# Altium project ControlBoard.PrjPcb (part 1 of 3)
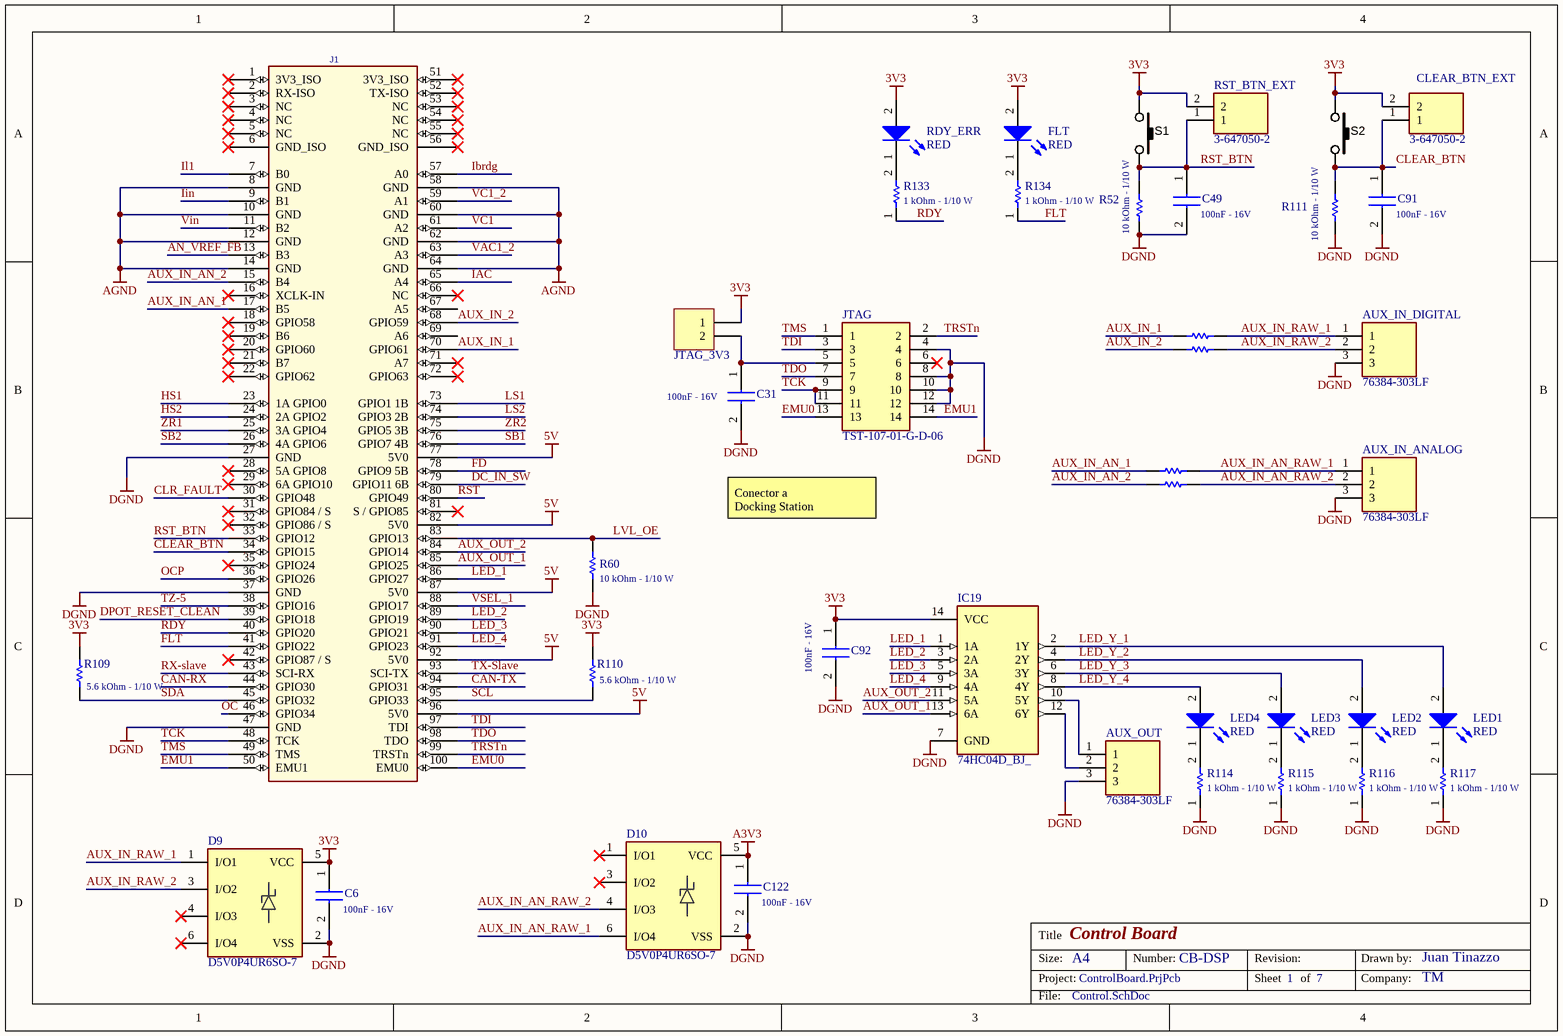
[diagram p0: Control.SchDoc]
REV: R8
7 sheets, 356 parts. Net scope: global (net labels, ports and power ports of the same name join across sheets).
Board file: PCB_ControlCard.PcbDoc
Sheets:
  Control.SchDoc
  Safety_Protections.SchDoc
  CAN.SchDoc
  Analogicas_Tension.SchDoc
  Analogicas_Corriente.SchDoc
  DriverSignals.SchDoc
  PSU.SchDoc

## Sheet Control.SchDoc: Control Board
size A4; CompanyName: TM; DrawnBy: Juan Tinazzo; Revision: R8; SheetNumber: 1; SheetTotal: 7; PageSetup: Record=PageOptions|CenterHorizontal=True|CenterVertical=True|PrintScale=1.20|XCorrection=1.00|YCorrection=1.00|PrintKind=1|BorderSize=5000000|LeftOffset=0|BottomOffset=0|Orientation=2|PaperLength=1000|PaperWidth=1000|Scale=100|PaperSource=7|PrintQuality=-3|MediaType=1|DitherType=10|PrintScaleMode=1|PaperKind=11 x 14 pulg.|PaperIndex=286; Number: CB-DSP

### Parts
AUX_IN_ANALOG  76384-303LF  [76384303LF]
AUX_IN_DIGITAL  76384-303LF  [76384303LF]
AUX_OUT  76384-303LF  [76384303LF]
C6  value 100nF - 16V  [CAPC1608X95N]  (hidden comment: 100n 16V 0603)
C31  value 100nF - 16V  [CAPC1608X95N]  (hidden comment: 100n 16V 0603)
C49  value 100nF - 16V  [CAPC1608X95N]  (hidden comment: 100n 16V 0603)
C91  value 100nF - 16V  [CAPC1608X95N]  (hidden comment: 100n 16V 0603)
C92  value 100nF - 16V  [CAPC1608X95N]  (hidden comment: 100n 16V 0603)
C122  value 100nF - 16V  [CAPC1608X95N]  (hidden comment: 100n 16V 0603)
CLEAR_BTN_EXT  3-647050-2  [36470502]
D9  D5V0P4UR6SO-7  [SOT95P285X140-6N]
D10  D5V0P4UR6SO-7  [SOT95P285X140-6N]
FLT  RED  [LEDC1608X80N]
IC19  74HC04D_BJ_  [SOIC127P600X175-14N]
J1  DIM100  [MOLEXDIMM-100-876301001_SD]  (value not drawn)
JTAG  TST-107-01-G-D-06  [TST10701GD06]
JTAG_3V3  Header 2  [HDR1X2]  (value not drawn)
LED1  RED  [LEDC1608X80N]
LED2  RED  [LEDC1608X80N]
LED3  RED  [LEDC1608X80N]
LED4  RED  [LEDC1608X80N]
R52  value 10 kOhm - 1/10 W  [RESC1608X50N]  (hidden comment: CRCW060310K0FKEA)
R60  value 10 kOhm - 1/10 W  [RESC1608X50N]  (hidden comment: CRCW060310K0FKEA)
R68  CRCW060375R0FKEAC  [RESC1608X55N]  (value not drawn)
R73  CRCW060375R0FKEAC  [RESC1608X55N]  (value not drawn)
R105  CRCW060375R0FKEAC  [RESC1608X55N]  (value not drawn)
R109  value 5.6 kOhm - 1/10 W  [RESC1608X50N]  (hidden comment: CRCW06035K60FKEA)
R110  value 5.6 kOhm - 1/10 W  [RESC1608X50N]  (hidden comment: CRCW06035K60FKEA)
R111  value 10 kOhm - 1/10 W  [RESC1608X50N]  (hidden comment: CRCW060310K0FKEA)
R114  value 1 kOhm - 1/10 W  [RESC1608X55N]  (hidden comment: CRCW06031K00FKEAC)
R115  value 1 kOhm - 1/10 W  [RESC1608X55N]  (hidden comment: CRCW06031K00FKEAC)
R116  value 1 kOhm - 1/10 W  [RESC1608X55N]  (hidden comment: CRCW06031K00FKEAC)
R117  value 1 kOhm - 1/10 W  [RESC1608X55N]  (hidden comment: CRCW06031K00FKEAC)
R121  CRCW060375R0FKEAC  [RESC1608X55N]  (value not drawn)
R133  value 1 kOhm - 1/10 W  [RESC1608X55N]  (hidden comment: CRCW06031K00FKEAC)
R134  value 1 kOhm - 1/10 W  [RESC1608X55N]  (hidden comment: CRCW06031K00FKEAC)
RDY_ERR  RED  [LEDC1608X80N]
RST_BTN_EXT  3-647050-2  [36470502]
S1  SW_THT_PB_5.0mm  [TACT_SWITCH_TL-1105-C]  (value not drawn)
S2  SW_THT_PB_5.0mm  [TACT_SWITCH_TL-1105-C]  (value not drawn)

### Nets
3V3: C6.1 C92.1 CLEAR_BTN_EXT.2 D9.5(VCC) FLT.2(A) IC19.14(VCC) JTAG_3V3.1 R109.2 R110.2 RDY_ERR.2(A) RST_BTN_EXT.2 S1.2 S2.2
5V: J1.77(5V0) J1.82(5V0) J1.87(5V0) J1.92(5V0) J1.96(5V0)
A3V3: C122.1 D10.5(VCC)
AGND: AUX_IN_ANALOG.3 AUX_IN_DIGITAL.3 AUX_OUT.3 C6.2 C31.2 C49.2 C91.2 C92.2 C122.2 D9.2(VSS) D10.2(VSS) IC19.7(GND) J1.8(GND) J1.10(GND) J1.12(GND) J1.14(GND) J1.27(GND) J1.37(GND) J1.47(GND) J1.58(GND) J1.60(GND) J1.62(GND) J1.64(GND) JTAG.4 JTAG.8 JTAG.10 JTAG.12 R52.1 R60.1 R111.1 R114.1 R115.1 R116.1 R117.1  [also labelled DGND]
AN_VREF_FB: J1.13(B3)
AUX_IN_1: J1.70(GPIO61) R68.1
AUX_IN_2: J1.68(GPIO59) R73.1
AUX_IN_AN_1: J1.17(B5) R105.1
AUX_IN_AN_2: J1.15(B4) R121.1
AUX_IN_AN_RAW_1: AUX_IN_ANALOG.1 D10.6(I/O4) R105.2
AUX_IN_AN_RAW_2: AUX_IN_ANALOG.2 D10.4(I/O3) R121.2
AUX_IN_RAW_1: AUX_IN_DIGITAL.1 D9.1(I/O1) R68.2
AUX_IN_RAW_2: AUX_IN_DIGITAL.2 D9.3(I/O2) R73.2
AUX_OUT_1: IC19.13(6A) J1.85(GPIO25)
AUX_OUT_2: IC19.11(5A) J1.84(GPIO14)
CAN-RX: J1.44(GPIO30)
CAN-TX: J1.94(GPIO31)
CLEAR_BTN: C91.1 CLEAR_BTN_EXT.1 J1.34(GPIO15) R111.2 S2.1
CLR_FAULT: J1.30(GPIO48)
DC_IN_SW: J1.79(GPIO11_6B)
DPOT_RESET_CLEAN: J1.39(GPIO18)
EMU0: J1.100(EMU0) JTAG.13
EMU1: J1.50(EMU1) JTAG.14
FD: J1.78(GPIO9_5B)
FLT: J1.41(GPIO22) R134.1
HS1: J1.23(1A_GPIO0)
HS2: J1.24(2A_GPIO2)
IAC: J1.65(A4)
Ibrdg: J1.57(A0)
Iin: J1.9(B1)
Il1: J1.7(B0)
LED_1: IC19.1(1A) J1.86(GPIO27)
LED_2: IC19.3(2A) J1.89(GPIO19)
LED_3: IC19.5(3A) J1.90(GPIO21)
LED_4: IC19.9(4A) J1.91(GPIO23)
LED_Y_1: IC19.2(1Y) LED1.2(A)
LED_Y_2: IC19.4(2Y) LED2.2(A)
LED_Y_3: IC19.6(3Y) LED3.2(A)
LED_Y_4: IC19.8(4Y) LED4.2(A)
LS1: J1.73(GPIO1_1B)
LS2: J1.74(GPIO3_2B)
LVL_OE: J1.83(GPIO13) R60.2
OC: J1.46(GPIO34)
OCP: J1.36(GPIO26)
RDY: J1.40(GPIO20) R133.1
RST: J1.80(GPIO49)
RST_BTN: C49.1 J1.33(GPIO12) R52.2 RST_BTN_EXT.1 S1.1
RX-slave: J1.43(SCI-RX)
SB1: J1.76(GPIO7_4B)
SB2: J1.26(4A_GPIO6)
SCL: J1.95(GPIO33) R110.1
SDA: J1.45(GPIO32) R109.1
TCK: J1.48(TCK) JTAG.9 JTAG.11
TDI: J1.97(TDI) JTAG.3
TDO: J1.98(TDO) JTAG.7
TMS: J1.49(TMS) JTAG.1
TRSTn: J1.99(TRSTn) JTAG.2
TX-Slave: J1.93(SCI-TX)
TZ-5: J1.38(GPIO16)
VAC1_2: J1.63(A3)
VC1: J1.61(A2)
VC1_2: J1.59(A1)
Vin: J1.11(B2)
VSEL_1: J1.88(GPIO17)
ZR1: J1.25(3A_GPIO4)
ZR2: J1.75(GPIO5_3B)
NetAUX_OUT_1: AUX_OUT.1 IC19.10(5Y)
NetAUX_OUT_2: AUX_OUT.2 IC19.12(6Y)
NetC31_1: C31.1 JTAG.5 JTAG_3V3.2
NetFLT_1: FLT.1(K) R134.2
NetLED1_1: LED1.1(K) R117.2
NetLED2_1: LED2.1(K) R116.2
NetLED3_1: LED3.1(K) R115.2
NetLED4_1: LED4.1(K) R114.2
NetR133_2: R133.2 RDY_ERR.1(K)

Not connected (* = marked no-connect by the designer): D9 4(I/O3)* 6(I/O4)*; D10 1(I/O1)* 3(I/O2)*; J1 1(3V3_ISO)* 2(RX-ISO)* 3(NC)* 4(NC)* 5(NC)* 6(GND_ISO)* 16(XCLK-IN)* 18(GPIO58)* 19(B6)* 20(GPIO60)* 21(B7)* 22(GPIO62)* 28(5A_GPIO8)* 29(6A_GPIO10)* 31(GPIO84_/_S)* 32(GPIO86_/_S)* 35(GPIO24)* 42(GPIO87_/_S)* 51(3V3_ISO)* 52(TX-ISO)* 53(NC)* 54(NC)* 55(NC)* 56(GND_ISO)* 66(NC)* 67(A5) 69(A6) 71(A7)* 72(GPIO63)* 81(S_/_GPIO85)*; JTAG 6*

### Notes on the sheet
- Conector a
  Docking Station
- Title
- Size:
- Project:
- A4
- Number:
- Revision:
- Sheet
- of
- Drawn by:
- Company:
- File:

### Library data of the parts
AUX_IN_ANALOG AUX_IN_DIGITAL AUX_OUT = 76384-303LF: Connector; Manufacturer_Name: Amphenol Communications Solutions; Value: Alojamientos de cables y cabecera 3P VERT; Datasheet Link: https://cdn.amphenol-cs.com/media/wysiwyg/files/drawing/76384.pdf; Height: 9.49mm; Manufacturer_Part_Number: 76384-303LF; Mouser Part Number: 649-76384-303LF
  AUX_IN_ANALOG: System: Connector
C6 C31 C49 C91 C92 C122 = EMK107B7104KA-T: Capacitor; Manufacturer_Name: TAIYO YUDEN; Datasheet Link: http://www.farnell.com/datasheets/746258.pdf; Height: 0.95mm; Manufacturer_Part_Number: EMK107B7104KA-T; Mouser Part Number: 963-EMK107B7104KA-T; Mouser Price/Stock: https://www.mouser.co.uk/ProductDetail/Taiyo-Yuden/EMK107B7104KA-T?qs=I6KAKw0tg2ybqzX8hKPgfw%3D%3D; Arrow Part Number: EMK107B7104KA-T; Arrow Price/Stock: https://www.arrow.com/en/products/emk107b7104ka-t/taiyo-yuden
CLEAR_BTN_EXT RST_BTN_EXT = 3-647050-2: Connector; Manufacturer_Name: TE Connectivity; Value: Button; Datasheet Link: https://www.te.com/commerce/DocumentDelivery/DDEController?Action=srchrtrv&DocNm=647050&DocType=Customer+Drawing&DocLang=English&PartCntxt=3-647050-2&DocFormat=pdf; Height: 10.79mm; Manufacturer_Part_Number: 3-647050-2; Mouser Part Number: 571-3-647050-2; Mouser Price/Stock: https://www.mouser.co.uk/ProductDetail/TE-Connectivity-AMP/3-647050-2?qs=W5ux9j661SpBFGFPk8vxRQ%3D%3D; System: Connector
D9 D10 = D5V0P4UR6SO-7: TVS Diode (Uni-directional); Manufacturer_Name: Diodes Inc.; Value: 4CH - Unidireccional - 3.3V - 800mW; Datasheet Link: https://www.arrow.com/en/products/d5v0p4ur6so-7/diodes-incorporated; Height: 1.4mm; Manufacturer_Part_Number: D5V0P4UR6SO-7; Mouser Part Number: 621-D5V0P4UR6SO-7; Mouser Price/Stock: https://www.mouser.co.uk/ProductDetail/Diodes-Incorporated/D5V0P4UR6SO-7?qs=rN85NNvew%2FSjbewGRfhy7A%3D%3D; Arrow Part Number: D5V0P4UR6SO-7; Arrow Price/Stock: https://www.arrow.com/en/products/d5v0p4ur6so-7/diodes-incorporated?region=nac
FLT LED1-LED4 RDY_ERR = 150060RS75000: LED; Manufacturer_Name: Wurth Elektronik; Value: Led Rojo 0603; Datasheet Link: http://katalog.we-online.de/led/datasheet/150060RS75000.pdf; Height: 0.8mm; Manufacturer_Part_Number: 150060RS75000; Mouser Part Number: 710-150060RS75000; Mouser Price/Stock: https://www.mouser.co.uk/ProductDetail/Wurth-Elektronik/150060RS75000?qs=LlUlMxKIyB3QnmZ3fw%2FVCA%3D%3D
IC19 = 74HC04D_BJ_: Integrated Circuit; Manufacturer_Name: Toshiba; Manufacturer_Part_Number: 74HC04D(BJ); Value: Inversores CMOS logic IC series; Datasheet Link: http://toshiba.semicon-storage.com/info/docget.jsp?did=37182&prodName=74HC04D; Height: 1.75mm; Mouser Part Number: 757-74HC04DBJ; Mouser Price/Stock: https://www.mouser.co.uk/ProductDetail/Toshiba/74HC04DBJ?qs=kdd6aVn74hyhHdfHNvZcvA%3D%3D; Arrow Part Number: 74HC04D(BJ); Arrow Price/Stock: https://www.arrow.com/en/products/74hc04d-bj/toshiba?region=europe
J1 = HDR_DIM_100: CONN, 100 pin DIMM socket - Molex 0876301001; Value: Conectores DIMM; Manufacturer_Part_Number: 0876301001
JTAG = TST-107-01-G-D-06: Connector; Manufacturer_Name: SAMTEC; Value: Alojamientos de cables y cabecera Shrouded PCB Headers, 0.100" pitch; Datasheet Link: https://www.arrow.com/en/products/tst-107-01-g-d-06/samtec; Height: 9.27mm; Manufacturer_Part_Number: TST-107-01-G-D-06; Mouser Part Number: 200-TST10701GD06; Mouser Price/Stock: https://www.mouser.co.uk/ProductDetail/Samtec/TST-107-01-G-D-06?qs=rU5fayqh%252BE2aRBN6ChnNCw%3D%3D; Arrow Part Number: TST-107-01-G-D-06; Arrow Price/Stock: https://www.arrow.com/en/products/tst-107-01-g-d-06/samtec?region=nac
JTAG_3V3 = Header 2: Header, 2-Pin; Manufacturer_Part_Number: Header 2.54 mm 2P; Value: Jumper
R52 R60 R111 = CRCW060310K0FKEA: Resistor; Manufacturer_Name: Vishay; Datasheet Link: http://www.vishay.com/docs/20035/dcrcwe3.pdf; Height: 0.5mm; Manufacturer_Part_Number: CRCW060310K0FKEA; Mouser Part Number: 71-CRCW0603-10K-E3; Mouser Price/Stock: https://www.mouser.co.uk/ProductDetail/Vishay-Dale/CRCW060310K0FKEA?qs=pAO1Z172M84BVnhDjtnsoQ%3D%3D; Arrow Part Number: CRCW060310K0FKEA; Arrow Price/Stock: https://www.arrow.com/en/products/crcw060310k0fkea/vishay?region=nac
R68 R73 R105 R121 = CRCW060375R0FKEAC: Resistor; Manufacturer_Name: Vishay; Value: 75 Ohm - 1/10 W; Datasheet Link: https://www.arrow.com/en/products/crcw060375r0fkeac/vishay; Height: 0.55mm; Manufacturer_Part_Number: CRCW060375R0FKEAC; Mouser Part Number: 71-CRCW060375R0FKEAC; Mouser Price/Stock: https://www.mouser.co.uk/ProductDetail/Vishay-Dale/CRCW060375R0FKEAC?qs=E3Y5ESvWgWPOxF9wqCfv4A%3D%3D; Arrow Part Number: CRCW060375R0FKEAC; Arrow Price/Stock: https://www.arrow.com/en/products/crcw060375r0fkeac/vishay?region=nac
R109 R110 = CRCW06035K60FKEA: Resistor; Manufacturer_Name: Vishay; Datasheet Link: http://www.vishay.com/docs/20035/dcrcwe3.pdf; Height: 0.5mm; Manufacturer_Part_Number: CRCW06035K60FKEA; Mouser Part Number: 71-CRCW0603-5.6K-E3; Mouser Price/Stock: https://www.mouser.co.uk/ProductDetail/Vishay-Dale/CRCW06035K60FKEA?qs=%2FAtLfjUBFoX1vHGCl0oHag%3D%3D; Arrow Part Number: CRCW06035K60FKEA; Arrow Price/Stock: https://www.arrow.com/en/products/crcw06035k60fkea/vishay
R114-R117 R133 R134 = CRCW06031K00FKEAC: Resistor; Manufacturer_Name: Vishay; Datasheet Link: https://www.vishay.com/docs/28773/crcwce3.pdf; Height: 0.55mm; Manufacturer_Part_Number: CRCW06031K00FKEAC; Mouser Part Number: 71-CRCW06031K00FKEAC; Mouser Price/Stock: https://www.mouser.co.uk/ProductDetail/Vishay-Dale/CRCW06031K00FKEAC?qs=E3Y5ESvWgWOQ7ePIWbGVFg%3D%3D; Arrow Part Number: CRCW06031K00FKEAC; Arrow Price/Stock: https://www.arrow.com/en/products/crcw06031k00fkeac/vishay?region=nac
S1 S2 = SW_THT_PB_5.0mm: Switch, tact, 5.0mm stem; Manufacturer 1: Wealth Metal; Manufacturer Part Number 1: TC-37XB; Manufacturer_Part_Number: STD Button; Function: On/Off; SCDType: spec; Value: 6.5x6.5mm; 5.0mm stem; Package / Case: 6.5x6.5mm; 5.0mm stem; Material: Brass/Nylon/Ag plating

## Sheet Safety_Protections.SchDoc: Safety Protections
size A3; DrawnBy: Juan Tinazzo; Revision: R8; SheetNumber: 2; SheetTotal: 7; Number: CB-SP; Company: TM
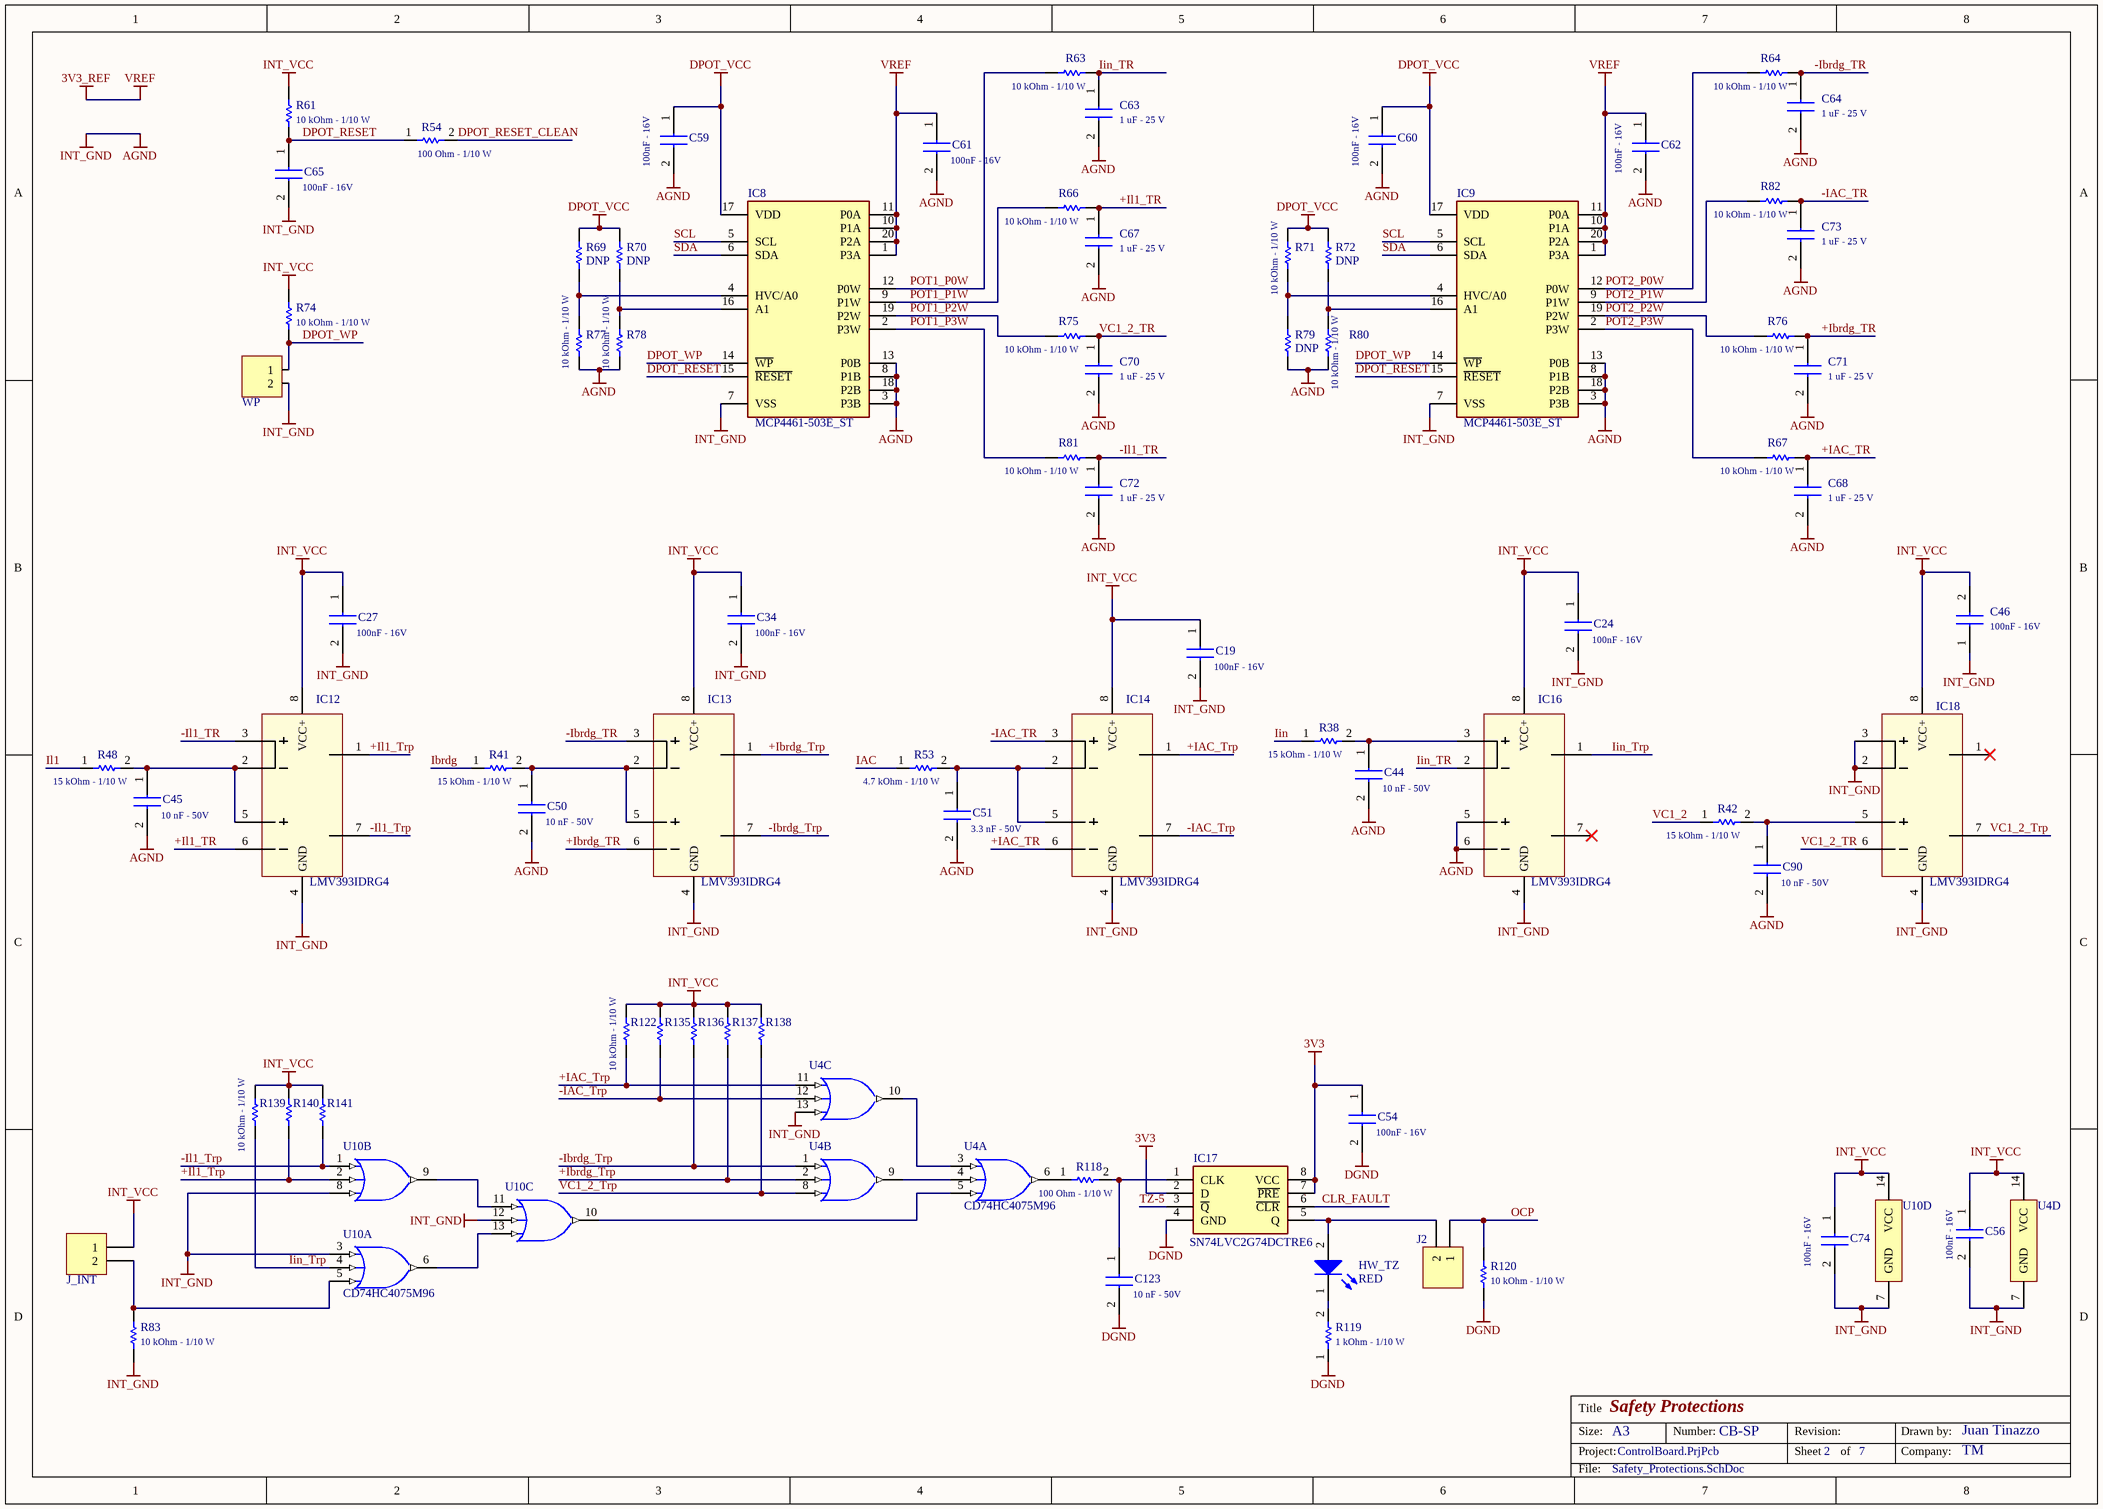
[diagram p1: Safety_Protections.SchDoc]

### Parts
C19  value 100nF - 16V  [CAPC1608X95N]  (hidden comment: 100n 16V 0603)
C24  value 100nF - 16V  [CAPC1608X95N]  (hidden comment: 100n 16V 0603)
C27  value 100nF - 16V  [CAPC1608X95N]  (hidden comment: 100n 16V 0603)
C34  value 100nF - 16V  [CAPC1608X95N]  (hidden comment: 100n 16V 0603)
C44  value 10 nF - 50V  [C0603]  (hidden comment: 220p 50V 5% 0603)
C45  value 10 nF - 50V  [C0603]  (hidden comment: 220p 50V 5% 0603)
C46  value 100nF - 16V  [CAPC1608X95N]  (hidden comment: 100n 16V 0603)
C50  value 10 nF - 50V  [C0603]  (hidden comment: 220p 50V 5% 0603)
C51  value 3.3 nF - 50V  [C0603]  (hidden comment: 220p 50V 5% 0603)
C54  value 100nF - 16V  [CAPC1608X95N]  (hidden comment: 100n 16V 0603)
C56  value 100nF - 16V  [CAPC1608X95N]  (hidden comment: 100n 16V 0603)
C59  value 100nF - 16V  [CAPC1608X95N]  (hidden comment: 100n 16V 0603)
C60  value 100nF - 16V  [CAPC1608X95N]  (hidden comment: 100n 16V 0603)
C61  value 100nF - 16V  [CAPC1608X95N]  (hidden comment: 100n 16V 0603)
C62  value 100nF - 16V  [CAPC1608X95N]  (hidden comment: 100n 16V 0603)
C63  value 1 uF - 25 V  [CAPC2012X135N]  (hidden comment: 1u)
C64  value 1 uF - 25 V  [CAPC2012X135N]  (hidden comment: 1u)
C65  value 100nF - 16V  [CAPC1608X95N]  (hidden comment: 100n 16V 0603)
C67  value 1 uF - 25 V  [CAPC2012X135N]  (hidden comment: 1u)
C68  value 1 uF - 25 V  [CAPC2012X135N]  (hidden comment: 1u)
C70  value 1 uF - 25 V  [CAPC2012X135N]  (hidden comment: 1u)
C71  value 1 uF - 25 V  [CAPC2012X135N]  (hidden comment: 1u)
C72  value 1 uF - 25 V  [CAPC2012X135N]  (hidden comment: 1u)
C73  value 1 uF - 25 V  [CAPC2012X135N]  (hidden comment: 1u)
C74  value 100nF - 16V  [CAPC1608X95N]  (hidden comment: 100n 16V 0603)
C90  value 10 nF - 50V  [C0603]  (hidden comment: 220p 50V 5% 0603)
C123  value 10 nF - 50V  [C0603]  (hidden comment: 220p 50V 5% 0603)
HW_TZ  RED  [LEDC1608X80N]
IC8  MCP4461-503E_ST  [SOP65P640X120-20N]
IC9  MCP4461-503E_ST  [SOP65P640X120-20N]
IC12  LMV393IDRG4  [SOIC127P600X175-8N]
IC13  LMV393IDRG4  [SOIC127P600X175-8N]
IC14  LMV393IDRG4  [SOIC127P600X175-8N]
IC16  LMV393IDRG4  [SOIC127P600X175-8N]
IC17  SN74LVC2G74DCTRE6  [SOP65P400X130-8N]
IC18  LMV393IDRG4  [SOIC127P600X175-8N]
J2  Header 2  [HDR1X2]  (value not drawn)
J_INT  Header 2  [HDR1X2]  (value not drawn)
R38  value 15 kOhm - 1/10 W  [RESC1608X55N]  (hidden comment: CRCW0603100RFKEBC)
R41  value 15 kOhm - 1/10 W  [RESC1608X55N]  (hidden comment: CRCW0603100RFKEBC)
R42  value 15 kOhm - 1/10 W  [RESC1608X55N]  (hidden comment: CRCW0603100RFKEBC)
R48  value 15 kOhm - 1/10 W  [RESC1608X55N]  (hidden comment: CRCW0603100RFKEBC)
R53  value 4.7 kOhm - 1/10 W  [RESC1608X55N]  (hidden comment: CRCW0603100RFKEBC)
R54  value 100 Ohm - 1/10 W  [RESC1608X55N]  (hidden comment: CRCW0603100RFKEBC)
R61  value 10 kOhm - 1/10 W  [RESC1608X50N]  (hidden comment: CRCW060310K0FKEA)
R63  value 10 kOhm - 1/10 W  [RESC1608X50N]  (hidden comment: CRCW060310K0FKEA)
R64  value 10 kOhm - 1/10 W  [RESC1608X50N]  (hidden comment: CRCW060310K0FKEA)
R66  value 10 kOhm - 1/10 W  [RESC1608X50N]  (hidden comment: CRCW060310K0FKEA)
R67  value 10 kOhm - 1/10 W  [RESC1608X50N]  (hidden comment: CRCW060310K0FKEA)
R69  DNP  [RESC1608X50N]
R70  DNP  [RESC1608X50N]
R71  value 10 kOhm - 1/10 W  [RESC1608X50N]  (hidden comment: CRCW060310K0FKEA)
R72  DNP  [RESC1608X50N]
R74  value 10 kOhm - 1/10 W  [RESC1608X50N]  (hidden comment: CRCW060310K0FKEA)
R75  value 10 kOhm - 1/10 W  [RESC1608X50N]  (hidden comment: CRCW060310K0FKEA)
R76  value 10 kOhm - 1/10 W  [RESC1608X50N]  (hidden comment: CRCW060310K0FKEA)
R77  value 10 kOhm - 1/10 W  [RESC1608X50N]  (hidden comment: CRCW060310K0FKEA)
R78  value 10 kOhm - 1/10 W  [RESC1608X50N]  (hidden comment: CRCW060310K0FKEA)
R79  DNP  [RESC1608X50N]
R80  value 10 kOhm - 1/10 W  [RESC1608X50N]  (hidden comment: CRCW060310K0FKEA)
R81  value 10 kOhm - 1/10 W  [RESC1608X50N]  (hidden comment: CRCW060310K0FKEA)
R82  value 10 kOhm - 1/10 W  [RESC1608X50N]  (hidden comment: CRCW060310K0FKEA)
R83  value 10 kOhm - 1/10 W  [RESC1608X50N]  (hidden comment: CRCW060310K0FKEA)
R118  value 100 Ohm - 1/10 W  [RESC1608X55N]  (hidden comment: CRCW0603100RFKEBC)
R119  value 1 kOhm - 1/10 W  [RESC1608X55N]  (hidden comment: CRCW06031K00FKEAC)
R120  value 10 kOhm - 1/10 W  [RESC1608X50N]  (hidden comment: CRCW060310K0FKEA)
R122  value 10 kOhm - 1/10 W  [RESC1608X50N]  (hidden comment: CRCW060310K0FKEA)
R135  CRCW060310K0FKEA  [RESC1608X50N]  (value not drawn)
R136  CRCW060310K0FKEA  [RESC1608X50N]  (value not drawn)
R137  CRCW060310K0FKEA  [RESC1608X50N]  (value not drawn)
R138  CRCW060310K0FKEA  [RESC1608X50N]  (value not drawn)
R139  value 10 kOhm - 1/10 W  [RESC1608X50N]  (hidden comment: CRCW060310K0FKEA)
R140  CRCW060310K0FKEA  [RESC1608X50N]  (value not drawn)
R141  CRCW060310K0FKEA  [RESC1608X50N]  (value not drawn)
U4  CD74HC4075M96  [SOIC127P600X175-14N]  (parts A,B,C,D of 4)
U10  CD74HC4075M96  [SOIC127P600X175-14N]  (parts A,B,C,D of 4)
WP  Header 2  [HDR1X2]  (value not drawn)

### Nets
3V3: C54.1 IC17.2(D) IC17.7(~{PRE}) IC17.8(VCC)
3V3_REF: C61.1 C62.1 IC8.1(P3A) IC8.10(P1A) IC8.11(P0A) IC8.20(P2A) IC9.1(P3A) IC9.10(P1A) IC9.11(P0A) IC9.20(P2A)  [also labelled VREF]
AGND: C19.2 C24.2 C27.2 C34.2 C44.2 C45.2 C46.1 C50.2 C51.2 C54.2 C56.2 C59.2 C60.2 C61.2 C62.2 C63.2 C64.2 C65.2 C67.2 C68.2 C70.2 C71.2 C72.2 C73.2 C74.2 C90.2 C123.2 IC8.3(P3B) IC8.7(VSS) IC8.8(P1B) IC8.13(P0B) IC8.18(P2B) IC9.3(P3B) IC9.7(VSS) IC9.8(P1B) IC9.13(P0B) IC9.18(P2B) IC12.4(GND) IC13.4(GND) IC14.4(GND) IC16.4(GND) IC16.5(2IN+) IC16.6(2IN-) IC17.4(GND) IC18.2(1IN-) IC18.3(1IN+) IC18.4(GND) R77.2 R78.2 R79.2 R80.2 R83.2 R119.1 R120.2 U4.7(GND) U4.13(3C) U10.3(1A) U10.7(GND) U10.8(2C) U10.12(3B) WP.2  [also labelled DGND, INT_GND]
DPOT_VCC: C59.1 C60.1 IC8.17(VDD) IC9.17(VDD) R69.1 R70.1 R71.1 R72.1
INT_VCC: C19.1 C24.1 C27.1 C34.1 C46.2 C56.1 C74.1 IC12.8(VCC+) IC13.8(VCC+) IC14.8(VCC+) IC16.8(VCC+) IC18.8(VCC+) J_INT.1 R61.1 R74.1 R122.1 R135.1 R136.1 R137.1 R138.1 R139.1 R140.1 R141.1 U4.14(VCC) U10.14(VCC)
+IAC_TR: C68.1 IC14.6(2IN-) R67.1
+IAC_Trp: IC14.1(1OUT) R122.2 U4.11(3A)
+Ibrdg_TR: C71.1 IC13.6(2IN-) R76.1
+Ibrdg_Trp: IC13.1(1OUT) R137.2 U4.2(2B)
+Il1_TR: C67.1 IC12.6(2IN-) R66.1
+Il1_Trp: IC12.1(1OUT) R140.2 U10.2(2B)
-IAC_TR: C73.1 IC14.3(1IN+) R82.1
-IAC_Trp: IC14.7(2OUT) R135.2 U4.12(3B)
-Ibrdg_TR: C64.1 IC13.3(1IN+) R64.1
-Ibrdg_Trp: IC13.7(2OUT) R136.2 U4.1(2A)
-Il1_TR: C72.1 IC12.3(1IN+) R81.1
-Il1_Trp: IC12.7(2OUT) R141.2 U10.1(2A)
CLR_FAULT: IC17.6(~{CLR})
DPOT_RESET: C65.1 IC8.15(~{RESET}) IC9.15(~{RESET}) R54.1 R61.2
DPOT_RESET_CLEAN: R54.2
DPOT_WP: IC8.14(~{WP}) IC9.14(~{WP}) R74.2 WP.1
IAC: R53.1
Ibrdg: R41.1
Iin: R38.1
Iin_TR: C63.1 IC16.2(1IN-) R63.1
Iin_Trp: IC16.1(1OUT) R139.2 U10.4(1B)
Il1: R48.1
OCP: J2.1 R120.1
POT1_P0W: IC8.12(P0W) R63.2
POT1_P1W: IC8.9(P1W) R66.2
POT1_P2W: IC8.19(P2W) R75.2
POT1_P3W: IC8.2(P3W) R81.2
POT2_P0W: IC9.12(P0W) R64.2
POT2_P1W: IC9.9(P1W) R82.2
POT2_P2W: IC9.19(P2W) R76.2
POT2_P3W: IC9.2(P3W) R67.2
SCL: IC8.5(SCL) IC9.5(SCL)
SDA: IC8.6(SDA) IC9.6(SDA)
TZ-5: IC17.3(~{Q})
VC1_2: R42.1
VC1_2_TR: C70.1 IC18.6(2IN-) R75.1
VC1_2_Trp: IC18.7(2OUT) R138.2 U4.8(2C)
NetC44_1: C44.1 IC16.3(1IN+) R38.2
NetC45_1: C45.1 IC12.2(1IN-) IC12.5(2IN+) R48.2
NetC50_1: C50.1 IC13.2(1IN-) IC13.5(2IN+) R41.2
NetC51_1: C51.1 IC14.2(1IN-) IC14.5(2IN+) R53.2
NetC90_1: C90.1 IC18.5(2IN+) R42.2
NetC123_1: C123.1 IC17.1(CLK) R118.2
NetHW_TZ_1: HW_TZ.1(K) R119.2
NetHW_TZ_2: HW_TZ.2(A) IC17.5(Q) J2.2
NetIC8_4: IC8.4(HVC/A0) R69.2 R77.1
NetIC8_16: IC8.16(A1) R70.2 R78.1
NetIC9_4: IC9.4(HVC/A0) R71.2 R79.1
NetIC9_16: IC9.16(A1) R72.2 R80.1
NetJ_INT_2: J_INT.2 R83.1 U10.5(1C)
NetR118_1: R118.1 U4.6(1Y)
NetU4_3: U4.3(1A) U4.10(3Y)
NetU4_4: U4.4(1B) U4.9(2Y)
NetU4_5: U4.5(1C) U10.10(3Y)
NetU10_6: U10.6(1Y) U10.13(3C)
NetU10_9: U10.9(2Y) U10.11(3A)

Not connected (* = marked no-connect by the designer): IC16 7(2OUT)*; IC18 1(1OUT)*

### Notes on the sheet
- Title
- Size:
- Project:
- A3
- Number:
- Revision:
- Sheet
- of
- Drawn by:
- Company:
- File:

### Library data of the parts
C19 C24 C27 C34 C46 C54 C56 C59-C62 C65 C74 = EMK107B7104KA-T: as C6 on sheet Control; Datasheet Link: http://www.farnell.com/datasheets/746258.pdf; Height: 0.95mm; Manufacturer_Part_Number: EMK107B7104KA-T; Mouser Part Number: 963-EMK107B7104KA-T; Arrow Part Number: EMK107B7104KA-T; Arrow Price/Stock: https://www.arrow.com/en/products/emk107b7104ka-t/taiyo-yuden
  C19 C24 C27 C34 C54 C56 C59-C62 C65 C74: Mouser Price/Stock: https://www.mouser.co.uk/ProductDetail/Taiyo-Yuden/EMK107B7104KA-T?qs=I6KAKw0tg2ybqzX8hKPgfw%3D%3D
  C46: Mouser Price/Stock: https://www.mouser.co.uk/ProductDetail/TAIYO-YUDEN/EMK107B7104KA-T?qs=I6KAKw0tg2ybqzX8hKPgfw%3D%3D
C44 C45 C50 C90 C123 = C0603C221J5HACAUTO: Capacitor; Manufacturer_Name: KEMET; Manufacturer_Part_Number: CGA3E2X7R1H103K080AA; Datasheet Link: https://content.kemet.com/datasheets/KEM_C1007_X8R_ULTRA_150C_SMD.pdf; Height: 0.87mm; Mouser Part Number: 80-C0603C221J5HAUTO; Mouser Price/Stock: https://www.mouser.co.uk/ProductDetail/KEMET/C0603C221J5HACAUTO?qs=j%252B1pi9TdxUZayjzZ3rh80g%3D%3D
C51 = C0603C221J5HACAUTO: Capacitor; Manufacturer_Name: KEMET; Datasheet Link: https://content.kemet.com/datasheets/KEM_C1007_X8R_ULTRA_150C_SMD.pdf; Height: 0.87mm; Manufacturer_Part_Number: C0603C221J5HACAUTO; Mouser Part Number: 80-C0603C221J5HAUTO; Mouser Price/Stock: https://www.mouser.co.uk/ProductDetail/KEMET/C0603C221J5HACAUTO?qs=j%252B1pi9TdxUZayjzZ3rh80g%3D%3D
C63 C64 C67 C68 C70-C73 = CL21B105KAFNNNG: Capacitor; Manufacturer_Name: SAMSUNG; Datasheet Link: https://datasheet.datasheetarchive.com/originals/distributors/Datasheets-DGA8/2478773.pdf; Height: 1.35mm; Manufacturer_Part_Number: CL21B105KAFNNNG; Mouser Part Number: 187-CL21B105KAFNNNG; Mouser Price/Stock: https://www.mouser.co.uk/ProductDetail/Samsung-Electro-Mechanics/CL21B105KAFNNNG?qs=yOVawPpwOwmXkU%252BG0TK%2F5g%3D%3D; Arrow Part Number: CL21B105KAFNNNG; Arrow Price/Stock: https://www.arrow.com/en/products/cl21b105kafnnng/samsung-electro-mechanics?region=europe
HW_TZ = 150060RS75000: as FLT on sheet Control; Datasheet Link: http://katalog.we-online.de/led/datasheet/150060RS75000.pdf; Height: 0.8mm; Manufacturer_Part_Number: 150060RS75000; Mouser Part Number: 710-150060RS75000; Mouser Price/Stock: https://www.mouser.co.uk/ProductDetail/Wurth-Elektronik/150060RS75000?qs=LlUlMxKIyB3QnmZ3fw%2FVCA%3D%3D
IC8 IC9 = MCP4461-503E_ST: Integrated Circuit; Manufacturer_Name: Microchip; Manufacturer_Part_Number: MCP4461-503E/ST; Value: Circuitos integrados de potenciómetros digitales 50k I2C quad ch 8bit nonvolatile memory; Datasheet Link: https://datasheet.datasheetarchive.com/originals/dk/DKDS-14/279656.pdf; Height: 1.2mm; Mouser Part Number: 579-MCP4461503EST; Mouser Price/Stock: https://www.mouser.co.uk/ProductDetail/Microchip-Technology/MCP4461-503E-ST?qs=hort8UWU32ogb6GG%252BEGOkQ%3D%3D; Arrow Part Number: MCP4461-503E/ST; Arrow Price/Stock: https://www.arrow.com/en/products/mcp4461-503est/microchip-technology
IC12-IC14 IC16 IC18 = LMV393IDRG4: Integrated Circuit; Manufacturer_Name: Texas Instruments; Value: Comparadores analógicos Dual Gen Purp; Datasheet Link: https://www.ti.com/lit/gpn/lmv393; Height: 1.75mm; Manufacturer_Part_Number: LMV393IDRG4; Mouser Part Number: 595-LMV393IDRG4; Mouser Price/Stock: https://www.mouser.co.uk/ProductDetail/Texas-Instruments/LMV393IDRG4?qs=tP77tliwutC5frth4oKpcg%3D%3D; Arrow Part Number: LMV393IDRG4; Arrow Price/Stock: https://www.arrow.com/en/products/lmv393idrg4/texas-instruments?region=nac
IC17 = SN74LVC2G74DCTRE6: Integrated Circuit; Manufacturer_Name: Texas Instruments; Value: Single Positive-Edge-Triggered D-Type Flip-Flop; Datasheet Link: https://www.ti.com/lit/ds/symlink/sn74lvc2g74.pdf?ts=1629109043918&ref_url=https%253A%252F%252Fwww.ti.com%252Fstore%252Fti%252Fen%252Fp%252Fproduct%252F%253Fp%253DSN74LVC2G74DCTRE6; Height: 1.3mm; Manufacturer_Part_Number: SN74LVC2G74DCTRE6; Mouser Part Number: 595-74LVC2G74DCTRE6; Mouser Price/Stock: https://www.mouser.co.uk/ProductDetail/Texas-Instruments/SN74LVC2G74DCTRE6?qs=byeeYqUIh0MaOLKxYGSbxw%3D%3D; Arrow Part Number: SN74LVC2G74DCTRE6; Arrow Price/Stock: https://www.arrow.com/en/products/sn74lvc2g74dctre6/texas-instruments?region=nac
J2 J_INT WP = Header 2: Header, 2-Pin; Manufacturer_Part_Number: Header 2.54 mm 2P; Value: 2P
R38 R41 R42 R48 = CRCW0603100RFKEBC: Resistor; Manufacturer_Name: Vishay; Manufacturer_Part_Number: CRCW060315K0FKEAC; Datasheet Link: https://www.vishay.com/docs/28773/crcwce3.pdf; Height: 0.55mm; Mouser Part Number: 71-CRCW0603100RFKEBC; Mouser Price/Stock: https://www.mouser.co.uk/ProductDetail/Vishay-Dale/CRCW0603100RFKEBC?qs=wd5RIQLrsJhdvQFtBw4oWg%3D%3D; Arrow Part Number: CRCW0603100RFKEBC; Arrow Price/Stock: https://www.arrow.com/en/products/crcw0603100rfkebc/vishay?region=nac
R53 = CRCW0603100RFKEBC: Resistor; Manufacturer_Name: Vishay; Manufacturer_Part_Number: CRCW06034K70FKEAHP; Datasheet Link: https://www.vishay.com/docs/28773/crcwce3.pdf; Height: 0.55mm; Mouser Part Number: 71-CRCW0603100RFKEBC; Mouser Price/Stock: https://www.mouser.co.uk/ProductDetail/Vishay-Dale/CRCW0603100RFKEBC?qs=wd5RIQLrsJhdvQFtBw4oWg%3D%3D; Arrow Part Number: CRCW0603100RFKEBC; Arrow Price/Stock: https://www.arrow.com/en/products/crcw0603100rfkebc/vishay?region=nac
R54 R118 = CRCW0603100RFKEBC: Resistor; Manufacturer_Name: Vishay; Datasheet Link: https://www.vishay.com/docs/28773/crcwce3.pdf; Height: 0.55mm; Manufacturer_Part_Number: CRCW0603100RFKEBC; Mouser Part Number: 71-CRCW0603100RFKEBC; Mouser Price/Stock: https://www.mouser.co.uk/ProductDetail/Vishay-Dale/CRCW0603100RFKEBC?qs=wd5RIQLrsJhdvQFtBw4oWg%3D%3D; Arrow Part Number: CRCW0603100RFKEBC; Arrow Price/Stock: https://www.arrow.com/en/products/crcw0603100rfkebc/vishay?region=nac
R61 R63 R64 R66 R67 R71 R74-R78 R80-R83 R120 R122 R139 = CRCW060310K0FKEA: Resistor; Manufacturer_Name: Vishay; Datasheet Link: http://www.vishay.com/docs/20035/dcrcwe3.pdf; Height: 0.5mm; Manufacturer_Part_Number: CRCW060310K0FKEA; Mouser Part Number: 71-CRCW0603-10K-E3; Mouser Price/Stock: https://www.mouser.co.uk/ProductDetail/Vishay-Dale/CRCW060310K0FKEA?qs=pAO1Z172M84BVnhDjtnsoQ%3D%3D; Arrow Part Number: CRCW060310K0FKEA; Arrow Price/Stock: https://www.arrow.com/en/products/crcw060310k0fkea/vishay?region=nac
R69 R70 R72 R79 R135-R138 R140 R141 = CRCW060310K0FKEA: Resistor; Manufacturer_Name: Vishay; Value: 10 kOhm - 1/10 W; Datasheet Link: http://www.vishay.com/docs/20035/dcrcwe3.pdf; Height: 0.5mm; Manufacturer_Part_Number: CRCW060310K0FKEA; Mouser Part Number: 71-CRCW0603-10K-E3; Mouser Price/Stock: https://www.mouser.co.uk/ProductDetail/Vishay-Dale/CRCW060310K0FKEA?qs=pAO1Z172M84BVnhDjtnsoQ%3D%3D; Arrow Part Number: CRCW060310K0FKEA; Arrow Price/Stock: https://www.arrow.com/en/products/crcw060310k0fkea/vishay?region=nac
R119 = CRCW06031K00FKEAC: Resistor; Manufacturer_Name: Vishay; Datasheet Link: https://www.vishay.com/docs/28773/crcwce3.pdf; Height: 0.55mm; Manufacturer_Part_Number: CRCW06031K00FKEAC; Mouser Part Number: 71-CRCW06031K00FKEAC; Mouser Price/Stock: https://www.mouser.co.uk/ProductDetail/Vishay-Dale/CRCW06031K00FKEAC?qs=E3Y5ESvWgWOQ7ePIWbGVFg%3D%3D; Arrow Part Number: CRCW06031K00FKEAC; Arrow Price/Stock: https://www.arrow.com/en/products/crcw06031k00fkeac/vishay?region=nac
U4 U10 = CD74HC4075M96: High Speed CMOS Logic Triple 3-Input OR Gates, D0014A, LARGE T&R; Manufacturer: Texas Instruments; VCC(Min)(V): 2; VCC(Max)(V): 6; ICC @ Nom Voltage(Max)(mA): 0.02; Bits(#): 3; F @ Nom Voltage(Max)(Mhz): 70; Rating: Catalog; Voltage(Nom)(V): 5; Output Drive (IOL/IOH)(Max)(mA): 5.2/-5.2; tpd @ Nom Voltage(Max)(ns): 25; Value: Puertas lógicas Triple 3-Input OR; DatasheetVersion: SCHS210G; PackageReference: D0014A; Generic Part Number: CD74HC4075; Output Type: CMOS; Input Type: CMOS; Operating Temperature Range(C): -55 to 125; Code_JEDEC: MS-012; PartNumber: CD74HC4075M96; ComponentLink1Description: Manufacturer URL; ComponentLink1URL: http://www.ti.com/; ComponentLink2Description: Datasheet; ComponentLink2URL: http://www.ti.com/lit/ds/symlink/cd74hc4075.pdf; ComponentLink3Description: Package Specification; ComponentLink3URL: http://www.ti.com/lit/ml/mpds177g/mpds177g.pdf; Datasheet Link: http://www.ti.com/lit/ds/symlink/cd74hc4075.pdf; Mouser Part Number: 595-CD74HC4075M96; Manufacturer_Part_Number: CD74HC4075M96

## Sheet CAN.SchDoc: CAN
size A4; CompanyName: TM; DrawnBy: Juan Tinazzo; Revision: R8; SheetNumber: 3; SheetTotal: 7; Number: 25
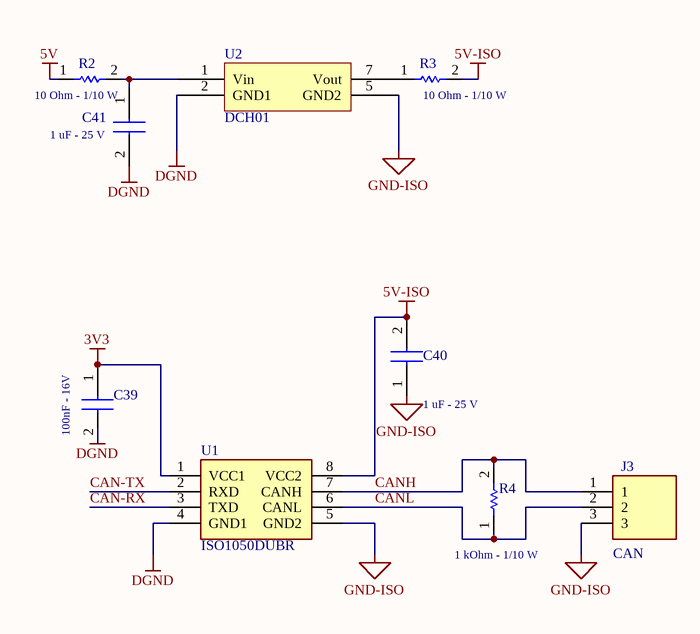
[diagram p2: CAN.SchDoc]

### Parts
C39  value 100nF - 16V  [CAPC1608X95N]  (hidden comment: 100n 16V 0603)
C40  value 1 uF - 25 V  [CAPC2012X135N]  (hidden comment: 1u)
C41  value 1 uF - 25 V  [CAPC2012X135N]  (hidden comment: 1u)
J3  CAN  [76384303LF]
R2  value 10 Ohm - 1/10 W  [RESC1608X50N]  (hidden comment: CRCW060310R0FKEAHP)
R3  value 10 Ohm - 1/10 W  [RESC1608X50N]  (hidden comment: CRCW060310R0FKEAHP)
R4  value 1 kOhm - 1/10 W  [RESC1608X55N]  (hidden comment: CRCW06031K00FKEAC)
U1  ISO1050DUBR  [SOP254P1040X485-8N]
U2  DCH01  [DCH01]

### Nets
3V3: C39.1 U1.1(VCC1)
5V: R2.1
5V-ISO: C40.2 R3.2 U1.8(VCC2)
DGND: C39.2 C41.2 U1.4(GND1) U2.2(GND1)  [project net AGND]
GND-ISO: C40.1 J3.3 U1.5(GND2) U2.5(GND2)
CAN-RX: U1.3(TXD)
CAN-TX: U1.2(RXD)
CANH: J3.1 R4.2 U1.7(CANH)
CANL: J3.2 R4.1 U1.6(CANL)
NetC41_1: C41.1 R2.2 U2.1(Vin)
NetR3_1: R3.1 U2.7(Vout)

### Notes on the sheet
- Title
- Size:
- Project:
- A4
- Number:
- Revision:
- Sheet
- of
- Drawn by:
- Company:
- File:

### Library data of the parts
C39 = EMK107B7104KA-T: as C6 on sheet Control; Datasheet Link: http://www.farnell.com/datasheets/746258.pdf; Height: 0.95mm; Manufacturer_Part_Number: EMK107B7104KA-T; Mouser Part Number: 963-EMK107B7104KA-T; Mouser Price/Stock: https://www.mouser.co.uk/ProductDetail/TAIYO-YUDEN/EMK107B7104KA-T?qs=I6KAKw0tg2ybqzX8hKPgfw%3D%3D; Arrow Part Number: EMK107B7104KA-T; Arrow Price/Stock: https://www.arrow.com/en/products/emk107b7104ka-t/taiyo-yuden
C40 C41 = CL21B105KAFNNNG: Capacitor; Manufacturer_Name: SAMSUNG; Datasheet Link: https://datasheet.datasheetarchive.com/originals/distributors/Datasheets-DGA8/2478773.pdf; Height: 1.35mm; Manufacturer_Part_Number: CL21B105KAFNNNG; Mouser Part Number: 187-CL21B105KAFNNNG; Mouser Price/Stock: https://www.mouser.co.uk/ProductDetail/Samsung-Electro-Mechanics/CL21B105KAFNNNG?qs=yOVawPpwOwmXkU%252BG0TK%2F5g%3D%3D; Arrow Part Number: CL21B105KAFNNNG; Arrow Price/Stock: https://www.arrow.com/en/products/cl21b105kafnnng/samsung-electro-mechanics?region=europe
J3 = 76384-303LF: as AUX_IN_ANALOG on sheet Control; Datasheet Link: https://cdn.amphenol-cs.com/media/wysiwyg/files/drawing/76384.pdf; Height: 9.49mm; Manufacturer_Part_Number: 76384-303LF; Mouser Part Number: 649-76384-303LF; System: Connector
R2 R3 = CRCW060310R0FKEAHP: Resistor; Manufacturer_Name: Vishay; Datasheet Link: http://www.farnell.com/datasheets/1885357.pdf; Height: 0.5mm; Manufacturer_Part_Number: CRCW060310R0FKEAHP; Mouser Part Number: 71-CRCW060310R0FKEAH; Mouser Price/Stock: https://www.mouser.co.uk/ProductDetail/Vishay-Dale/CRCW060310R0FKEAHP?qs=k2%2FDWSARqgHKJ7AdmQKyZw%3D%3D; Arrow Part Number: CRCW060310R0FKEAHP; Arrow Price/Stock: https://www.arrow.com/en/products/crcw060310r0fkeahp/vishay?region=nac
R4 = CRCW06031K00FKEAC: Resistor; Manufacturer_Name: Vishay; Datasheet Link: https://www.vishay.com/docs/28773/crcwce3.pdf; Height: 0.55mm; Manufacturer_Part_Number: CRCW06031K00FKEAC; Mouser Part Number: 71-CRCW06031K00FKEAC; Mouser Price/Stock: https://www.mouser.co.uk/ProductDetail/Vishay-Dale/CRCW06031K00FKEAC?qs=E3Y5ESvWgWOQ7ePIWbGVFg%3D%3D; Arrow Part Number: CRCW06031K00FKEAC; Arrow Price/Stock: https://www.arrow.com/en/products/crcw06031k00fkeac/vishay?region=nac
U1 = ISO1050DUBR: Integrated Circuit; Manufacturer_Name: Texas Instruments; Value: Aisladores digitales Iso 5V CAN Xcvr; Datasheet Link: http://www.ti.com/lit/ds/symlink/iso1050.pdf; Height: 4.85mm; Manufacturer_Part_Number: ISO1050DUBR; Mouser Part Number: 595-ISO1050DUBR; Mouser Price/Stock: https://www.mouser.co.uk/ProductDetail/Texas-Instruments/ISO1050DUBR?qs=IK5e5L0zOXhhp9hdAolE%252BA%3D%3D; Arrow Part Number: ISO1050DUBR; Arrow Price/Stock: https://www.arrow.com/en/products/iso1050dubr/texas-instruments?region=nac
U2 = DCH01: Value: Miniature Isolated DC/DC Converters; Manufacturer_Part_Number: DCH01